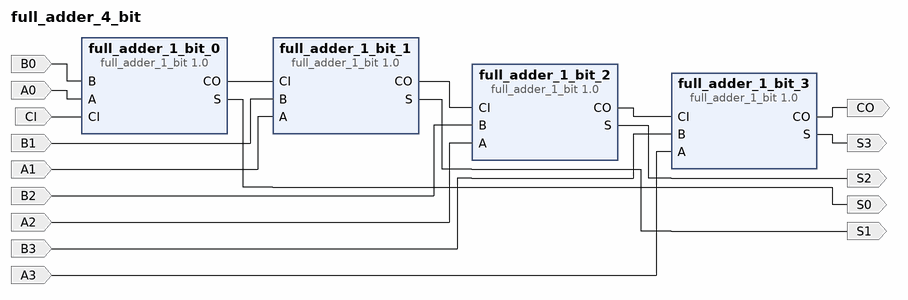
[diagram p0: block diagram of the top level]
# Vivado block design full_adder_4_bit, xc7a35tcpg236-1, Vivado 2016.3
create_bd_design full_adder_4_bit

create_bd_port -dir I A0
create_bd_port -dir I A1
create_bd_port -dir I A2
create_bd_port -dir I A3
create_bd_port -dir I B0
create_bd_port -dir I B1
create_bd_port -dir I B2
create_bd_port -dir I B3
create_bd_port -dir O S0
create_bd_port -dir O S1
create_bd_port -dir O S2
create_bd_port -dir O S3
create_bd_port -dir O CO
create_bd_port -dir I CI

create_bd_cell -type ip -vlnv xilinx.com:user:full_adder_1_bit:1.0 full_adder_1_bit_0
create_bd_cell -type ip -vlnv xilinx.com:user:full_adder_1_bit:1.0 full_adder_1_bit_1
create_bd_cell -type ip -vlnv xilinx.com:user:full_adder_1_bit:1.0 full_adder_1_bit_2
create_bd_cell -type ip -vlnv xilinx.com:user:full_adder_1_bit:1.0 full_adder_1_bit_3

# ---- connections ----

connect_bd_net -net B0_1 [get_bd_ports B0] [get_bd_pins full_adder_1_bit_0/B]
connect_bd_net -net A0_1 [get_bd_ports A0] [get_bd_pins full_adder_1_bit_0/A]
connect_bd_net [get_bd_pins full_adder_1_bit_0/S] [get_bd_ports S0]
connect_bd_net [get_bd_pins full_adder_1_bit_0/CO] [get_bd_pins full_adder_1_bit_1/CI]
connect_bd_net -net B1_1 [get_bd_ports B1] [get_bd_pins full_adder_1_bit_1/B]
connect_bd_net -net A1_1 [get_bd_ports A1] [get_bd_pins full_adder_1_bit_1/A]
connect_bd_net [get_bd_pins full_adder_1_bit_1/S] [get_bd_ports S1]
connect_bd_net [get_bd_pins full_adder_1_bit_1/CO] [get_bd_pins full_adder_1_bit_2/CI]
connect_bd_net -net B2_1 [get_bd_ports B2] [get_bd_pins full_adder_1_bit_2/B]
connect_bd_net -net A2_1 [get_bd_ports A2] [get_bd_pins full_adder_1_bit_2/A]
connect_bd_net [get_bd_pins full_adder_1_bit_2/S] [get_bd_ports S2]
connect_bd_net [get_bd_pins full_adder_1_bit_2/CO] [get_bd_pins full_adder_1_bit_3/CI]
connect_bd_net -net B3_1 [get_bd_ports B3] [get_bd_pins full_adder_1_bit_3/B]
connect_bd_net -net A3_1 [get_bd_ports A3] [get_bd_pins full_adder_1_bit_3/A]
connect_bd_net [get_bd_pins full_adder_1_bit_3/S] [get_bd_ports S3]
connect_bd_net [get_bd_pins full_adder_1_bit_3/CO] [get_bd_ports CO]
connect_bd_net [get_bd_ports CI] [get_bd_pins full_adder_1_bit_0/CI]

validate_bd_design
save_bd_design
